# Altium schematic sheet main.SchDoc
size A3
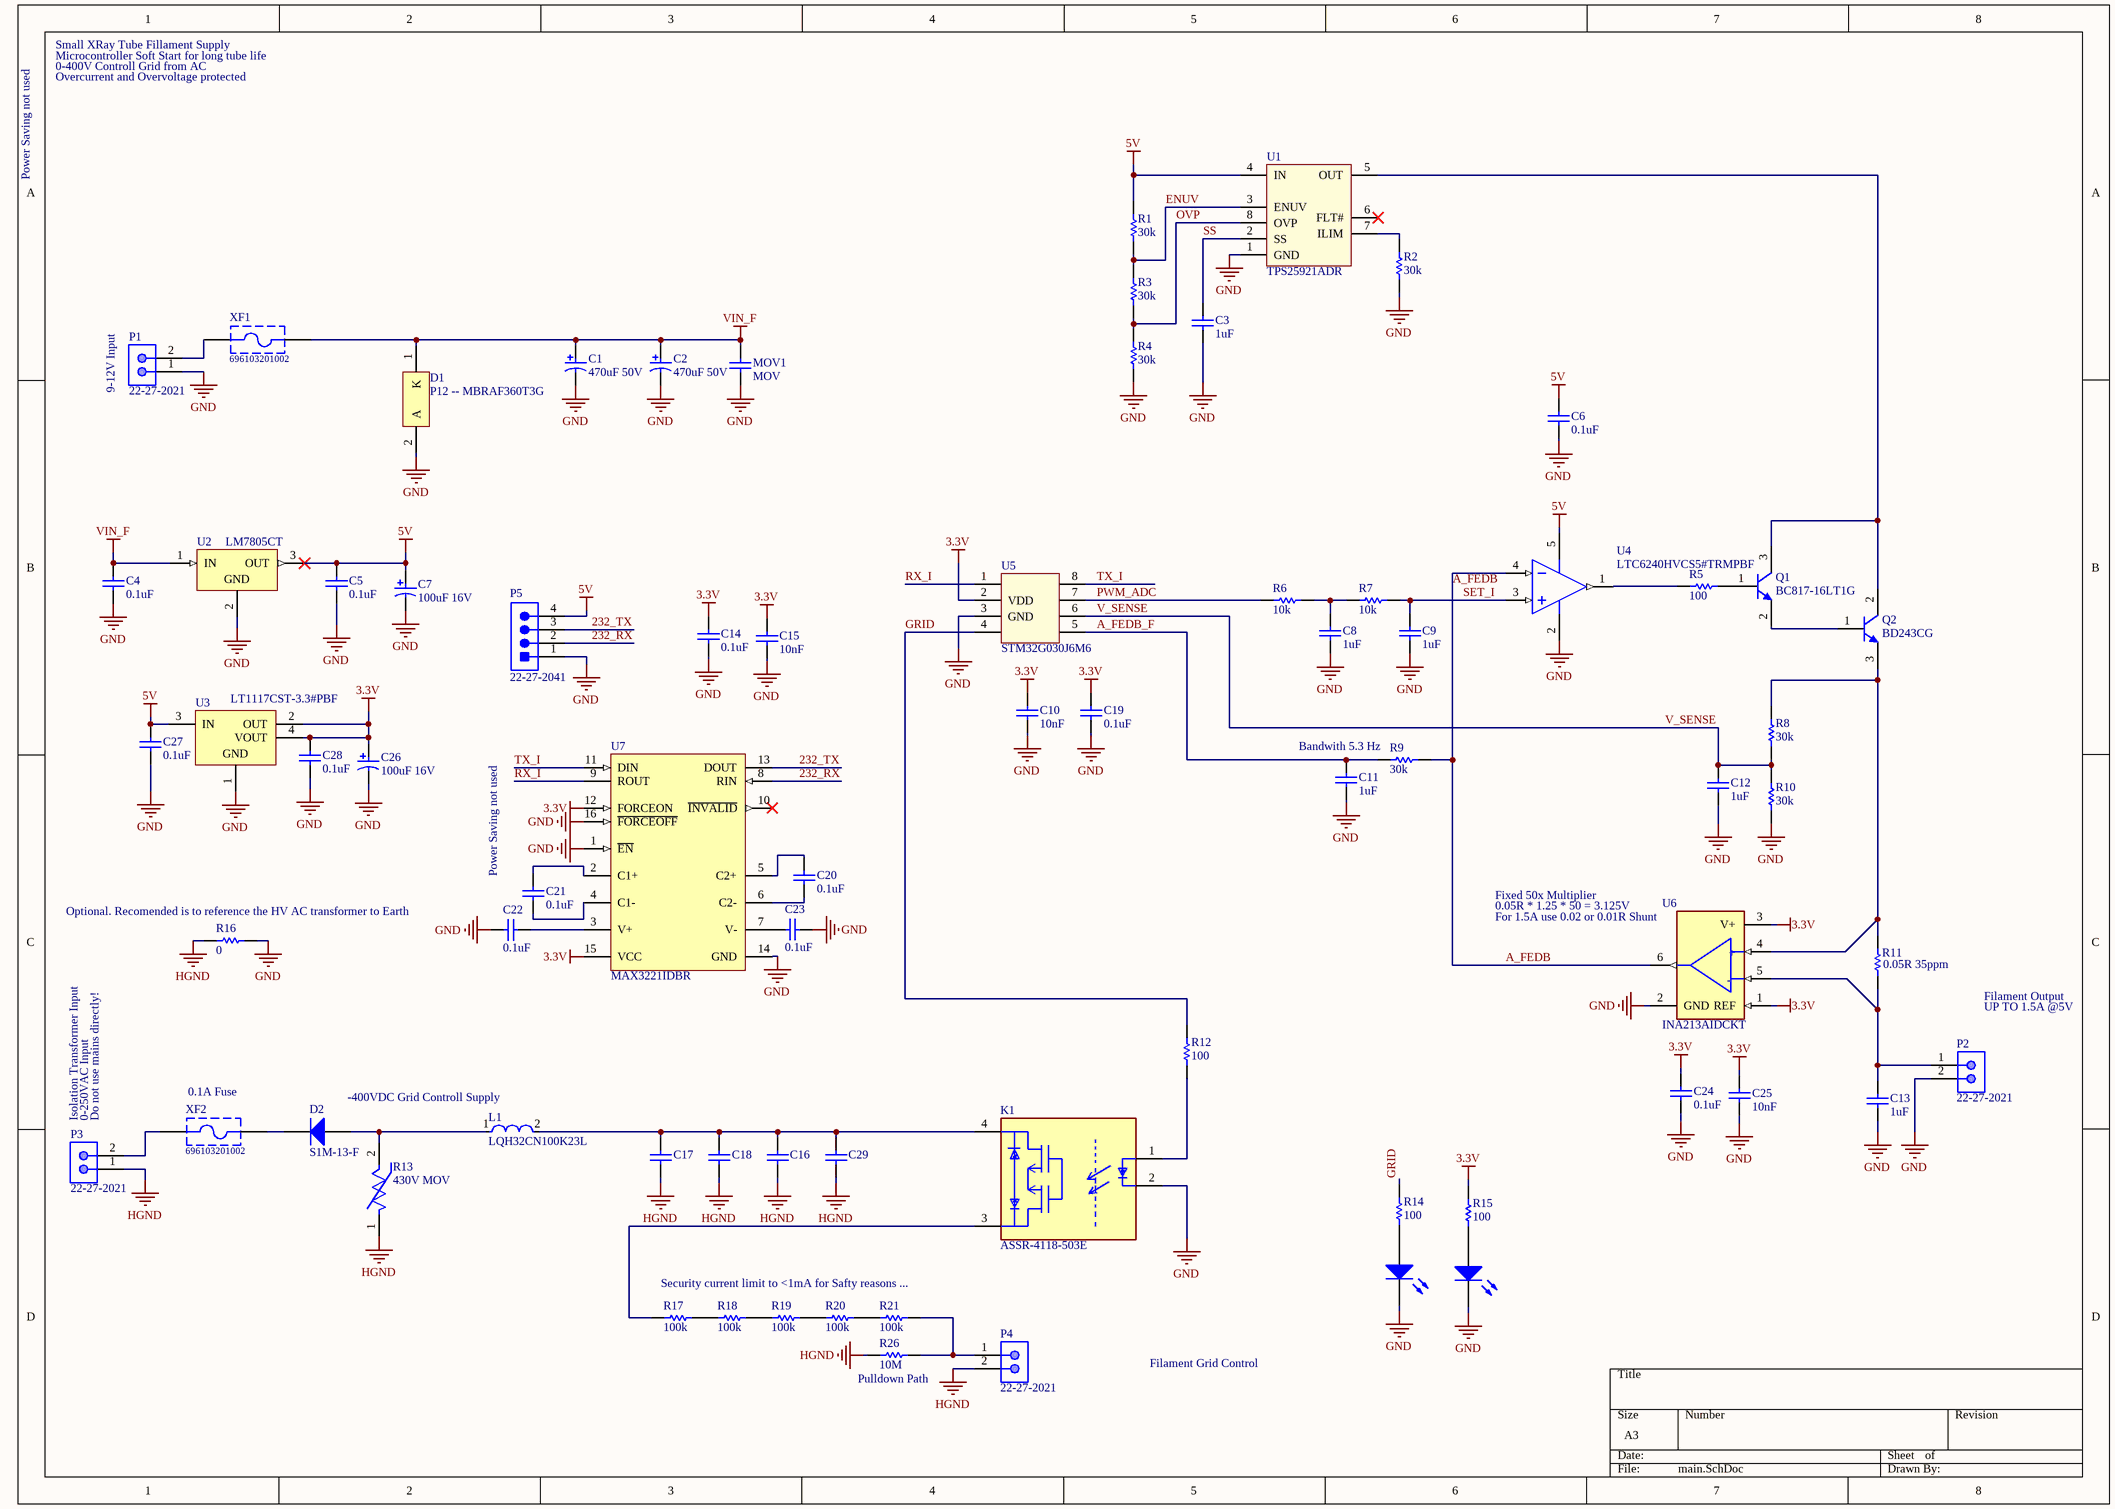
[diagram p0: main.SchDoc]

## Parts
C1  470uF 50V  [PNSC-CAP-10x20-P2]
C2  470uF 50V  [PNSC-CAP-10x20-P2]
C3  1uF  [CAPC2013X145X50LL20T25]
C4  0.1uF  [CAPC2013X145X50LL20T25]
C5  0.1uF  [CAPC2013X145X50LL20T25]
C6  0.1uF  [CAPC2013X145X50LL20T25]
C7  100uF 16V  [CAPPR55-250-1120X630X1220]
C8  1uF  [CAPC2013X145X50LL20T25]
C9  1uF  [CAPC2013X145X50LL20T25]
C10  10nF  [CAPC2013X145X50LL20T25]
C11  1uF  [CAPC2013X145X50LL20T25]
C12  1uF  [CAPC2013X145X50LL20T25]
C13  1uF  [CAPC2013X145X50LL20T25]
C14  0.1uF  [CAPC2013X145X50LL20T25]
C15  10nF  [CAPC2013X145X50LL20T25]
C16  20uF 50V X7R  [CAPC3216X180X50LL20T30]  (value not drawn)
C17  20uF 50V X7R  [CAPC3216X180X50LL20T30]  (value not drawn)
C18  20uF 50V X7R  [CAPC3216X180X50LL20T30]  (value not drawn)
C19  0.1uF  [CAPC2013X145X50LL20T25]
C20  0.1uF  [CAPC2013X145X50LL20T25]
C21  0.1uF  [CAPC2013X145X50LL20T25]
C22  0.1uF  [CAPC2013X145X50LL20T25]
C23  0.1uF  [CAPC2013X145X50LL20T25]
C24  0.1uF  [CAPC2013X145X50LL20T25]
C25  10nF  [CAPC2013X145X50LL20T25]
C26  100uF 16V  [CAPPR55-250-1120X630X1220]
C27  0.1uF  [CAPC2013X145X50LL20T25]
C28  0.1uF  [CAPC2013X145X50LL20T25]
C29  20uF 50V X7R  [CAPC3216X180X50LL20T30]  (value not drawn)
D1  P12 -- MBRAF360T3G  [ONSC-SMA-FL-2-403AA-01_V]
D2  S1M-13-F  [DIOD-S1M-13-F-SMA-2_V]
K1  ASSR-4118-503E  [FP-SO-4-MFG]
L1  LQH32CN100K23L  [FP-LQH32CN100K23L-MFG]
LED1  LED  [0805_A]  (value not drawn)
LED2  LED  [0805_A]  (value not drawn)
MOV1  MOV  [CAPC1206(3216)100_N]
P1  22-27-2021  [MOLX-22-27-2021_V]
P2  22-27-2021  [MOLX-22-27-2021_V]
P3  22-27-2021  [MOLX-22-27-2021_V]
P4  22-27-2021  [MOLX-22-27-2021_V]
P5  22-27-2041  [MOLX-22-27-2041_V]
Q1  BC817-16LT1G  [ONSC-SOT-23-3-318-08_V]
Q2  BD243CG  [ONSC-TO-220-3-221A-09]
R1  30k  [RESC2013X60X40NL20T25]
R2  30k  [RESC2013X60X40NL20T25]
R3  30k  [RESC2013X60X40NL20T25]
R4  30k  [RESC2013X60X40NL20T25]
R5  100  [RESC2013X60X40NL20T25]
R6  10k  [RESC2013X60X40NL20T25]
R7  10k  [RESC2013X60X40NL20T25]
R8  30k  [RESC2013X60X40NL20T25]
R9  30k  [RESC2013X60X40NL20T25]
R10  30k  [RESC2013X60X40NL20T25]
R11  0.05R 35ppm  [RESC3216X60X45ML10T20]
R12  100  [RESC2013X60X40NL20T25]
R13  430V MOV  [FP-B72220S0-MFG]
R14  100  [RESC2013X60X40NL20T25]
R15  100  [RESC2013X60X40NL20T25]
R16  0  [RESC2013X60X40NL20T25]
R17  100k  [RESC2013X50X30NL20T20]
R18  100k  [RESC2013X50X30NL20T20]
R19  100k  [RESC2013X50X30NL20T20]
R20  100k  [RESC2013X50X30NL20T20]
R21  100k  [RESC2013X50X30NL20T20]
R26  10M  [RESC2013X50X30NL20T20]
U1  TPS25921ADR  [SOIC8]
U2  LM7805CT  [FAIR-TO-220-3]
U3  LT1117CST-3.3#PBF  [LT-ST-3-SOT-223_M]
U4  LTC6240HVCS5#TRMPBF  [LT-S5-5-TSOT-23_N]
U5  STM32G030J6M6  [SOIC8]
U6  INA213AIDCKT  [FP-DCK0006A-MFG]
U7  MAX3221IDBR  [DB0016A_L]
XF1  696103201002  [696103201002]
XF2  696103201002  [696103201002]

## Nets
3.3V: C10.2 C14.2 C15.2 C19.2 C24.2 C25.2 C26.1 C28.2 R15.1 U3.2(OUT) U3.4(VOUT) U5.2(VDD) U6.1(REF) U6.3(V+) U7.12(FORCEON) U7.15(VCC)
5V: C5.2 C6.2 C7.1 C27.2 P5.4 R1.1 U1.4(IN) U2.3(OUT) U3.3(IN) U4.5(V+)
GND: C1.2 C2.2 C3.1 C4.1 C5.1 C6.1 C7.2 C8.1 C9.1 C10.1 C11.1 C12.1 C13.1 C14.1 C15.1 C19.1 C22.2 C23.1 C24.1 C25.1 C26.2 C27.1 C28.1 D1.2(A) K1.2(C) LED1.1(K) LED2.1(K) MOV1.1 P1.1 P2.2 P5.1 R2.2 R4.2 R10.1 R16.1 U1.1(GND) U2.2(GND) U3.1(GND) U4.2(V-) U5.3(GND) U6.2(GND) U7.1(~{EN}) U7.14(GND) U7.16(~{FORCEOFF})
HGND: C16.1 C17.1 C18.1 C29.1 P3.1 P4.2 R13.1 R16.2 R26.1
VIN_F: C1.1 C2.1 C4.2 D1.1(K) MOV1.2 U2.1(IN) XF1.2
232_RX: P5.2 U7.8(RIN)
232_TX: P5.3 U7.13(DOUT)
A_FEDB: R9.2 U4.4(-IN) U6.6(OUT)
A_FEDB_F: C11.2 R9.1 U5.5
ENUV: R1.2 R3.1 U1.3(ENUV)
GRID: R12.1 R14.1 U5.4
OVP: R3.2 R4.1 U1.8(OVP)
PWM_ADC: R6.2 U5.7
RX_I: U5.1 U7.9(ROUT)
SET_I: C9.2 R7.1 U4.3(+IN)
SS: C3.2 U1.2(SS)
TX_I: U5.8 U7.11(DIN)
V_SENSE: C12.2 R8.1 R10.2 U5.6
NetC8_2: C8.2 R6.1 R7.2
NetC13_2: C13.2 P2.1 R11.1 U6.5(IN-)
NetC16_2: C16.2 C17.2 C18.2 C29.2 K1.4(2_DRAIN) L1.2
NetC20_1: C20.1 U7.6(C2-)
NetC20_2: C20.2 U7.5(C2+)
NetC21_1: C21.1 U7.4(C1-)
NetC21_2: C21.2 U7.2(C1+)
NetC22_1: C22.1 U7.3(V+)
NetC23_2: C23.2 U7.7(V-)
NetD2_1: D2.1(A) L1.1 R13.2
NetD2_2: D2.2(K) XF2.2
NetK1_1: K1.1(A) R12.2
NetK1_3: K1.3(1_DRAIN) R17.1
NetLED1_2: LED1.2(A) R14.2
NetLED2_2: LED2.2(A) R15.2
NetP1_2: P1.2 XF1.1
NetP3_2: P3.2 XF2.1
NetP4_1: P4.1 R21.2 R26.2
NetQ1_1: Q1.1(B) R5.1
NetQ1_2: Q1.2(E) Q2.1(B)
NetQ1_3: Q1.3(C) Q2.2(C) U1.5(OUT)
NetQ2_3: Q2.3(E) R8.2 R11.2 U6.4(IN+)
NetR2_1: R2.1 U1.7(ILIM)
NetR5_2: R5.2 U4.1(OUT)
NetR17_2: R17.2 R18.1
NetR18_2: R18.2 R19.1
NetR19_2: R19.2 R20.1
NetR20_2: R20.2 R21.1

Not connected (* = marked no-connect by the designer): U1 6(FLT#)*; U7 10(~{INVALID})*

## Notes on the sheet
- Small XRay Tube Fillament Supply
- Microcontroller Soft Start for long tube life
- 0-400V Controll Grid from AC
- Overcurrent and Overvoltage protected
- Power Saving not used
- (near P1) 9-12V Input
- (near R9) Bandwith 5.3 Hz
- Optional. Recomended is to reference the HV AC transformer to Earth
- Fixed 50x Multiplier
- (near U6) 0.05R * 1.25 * 50 = 3.125V
- (near U6) For 1.5A use 0.02 or 0.01R Shunt
- Filament Output
- UP TO 1.5A @5V
- (near P3) Isolation Transformer Input
- (near P3) 0-250VAC Input
- (near P3) Do not use mains directly!
- (near XF2) 0.1A Fuse
- -400VDC Grid Controll Supply
- Security current limit to <1mA for Safty reasons ...
- (near R26) Pulldown Path
- Filament Grid Control
- (in symbol CMP-04895-000035-1) +; -

## Library data of the parts
C1 C2 = CMP-2000-05308-1: Aluminum Electrolytic Capacitor, 470 uF, +/- 20%, 50 V, -55 to 105 degC, 2-Pin THD, RoHS, Bulk; Manufacturer: Panasonic; Package Version: Nov-12; Type: Radial; Lifetime@Temperature: 2000Hrs@105degC; Capacitance: 470µF; Ripple Current: 530mA; Case Size/Dimension: Ø10x20mm; Package Reference: CAP-10x20-P2; Package Description: 2-Pin Through Hole Device, Dia 10 mm, Body Length 20 mm, Pin Spacing 5 mm; Series: NHG; Datasheet Version: Nov-12; Datasheet URL: http://www.alliedelec.com/images/products/datasheets/bm/Panasonic/70067776.pdf; Package URL: http://www.alliedelec.com/images/products/datasheets/bm/Panasonic/70067776.pdf; Operating Temp-Max: 105degC; Operating Temp Range: -55to+105degC; Manufacturer URL: http://www.panasonic.com/; Rated Voltage: 50V
C3-C6 C8-C15 C19-C25 C27 C28 = CMP-2007-01016-1: Manufacturer: Kemet; Part Number: C0805C105K4PACTU
C7 C26 = CMP-1665-00015-4: Aluminum Electrolytic Capacitor (Radial Lead Type), 100 uF, 35 V, -40 to 85 degC, 2-Pin THD, RoHS, Bulk; Manufacturer: Panasonic; Voltage Rating: 35 V; PackageReference: Radial; ComponentLink2URL: http://industrial.panasonic.com/cdbs/www-data/pdf/RDF0000/ABA0000C1047.pdf; DatasheetVersion: 03/2016; REACH SVHC: No SVHC; Mounting Technology: Through Hole; ComponentLink2Description: Datasheet; Packaging: Bulk; Lead Pitch: 2.5 mm; Height: 11.2 mm; Pins: 2; RoHSCompliant: true; Mount: Through Hole; Package Quantity: 200; Min Operating Temperature: -40 degC; Max Operating Temperature: 85 degC; PackageDescription: 2-Pin Through Hole Device, Dia 6.3 mm, Body Length 11.2 mm; ComponentLink1Description: Manufacturer URL; Length: 11.2 mm; ComponentLink1URL: http://www.panasonic.com/
C16-C18 C29 = CMP-2000-07530-1: HighVoltaeCaps; Manufacturer: Samsung Electro-Mechanics; Package Reference: 1206; Package Description: 2-Pin Surface Mount Device, Body 3.2 x 1.6 mm; Datasheet URL: https://media.digikey.com/pdf/Data%20Sheets/Samsung%20PDFs/CL_Series_MLCC_ds.pdf; Manufacturer URL: http://www.samsungsem.com/global/index.jsp; Datasheet Version: 07/2008; Mounting Technology: SurfaceMount
D1 = CMP-1055-00332-1: P12 -- Schottky Power Rectifier, 2-Pin SMA, Pb-Free, Tape and Reel; Manufacturer: On Semiconductor; Configuration: Single; Note1: 0; IFSM Max (A): 125; ComponentLink2Description: Datasheet; ComponentLink3URL: http://www.onsemi.com/pub_link/Collateral/403AA.PDF; ComponentLink1Description: Manufacturer URL; PackageReference: SMA-FL-2-403AA-01; ComponentLink2URL: http://www.onsemi.cn/pub_link/Collateral/MBRAF360-D.PDF; PartNumber: MBRAF360T3G; RoHS: TRUE; DatasheetVersion: Rev. 0; PackageDescription: 2-Pin Small Molded Package, Body 2.6 x 4.3 mm; ComponentLink1URL: http://www.onsemi.com/; Packing: Tape and Reel; ComponentLink3Description: Package Specification; Mounting Technology: Surface Mount; PackageVersion: Rev. O, 03/2011
D2 = CMP-0639-00001-1: Surface Mount Glass Passivated Rectifier, 1000V, 1 A, -65 to 125 degC, 2-Pin SMA Package, RoHS, Tape and Reel; Manufacturer: Diodes Inc; Maximum Reverse Current IR (uA): 5; Maximum Peak Forward Surge Current IFSM (A): 30; Maximum Average Rectified Current IO (A): 1; Peak Repetitive Reverse Voltage VRRM (V): 1000; Total Capacitance CT (pF): 10; Forward Voltage Drop VF (V): 1.1; ComponentLink1URL: http://www.diodes.com/; Operating Temperature Range: -65 to 150 degC; ComponentLink3URL: http://diodes.com/datasheets/ds16003.pdf; ComponentLink3Description: Package Specification; PackageDescription: 2-Pin SMD, Body 4.3 x 2.605 mm, Height 2.3 mm; Mounting Technology: Surface Mount; ComponentLink1Description: Manufacturer URL; PackageReference: S1M-13-F-SMA-2; ComponentLink2URL: http://diodes.com/datasheets/ds16003.pdf; ComponentLink2Description: Datasheet; RoHS: TRUE; DatasheetVersion: Rev. 22 - 2; Packing: Tape and Reel; PackageVersion: Rev. 22 - 2; PartNumber: S1M-13-F
K1 = CMP-18473-000001-1: SSR RELAY SPST-NO 100MA 0-400V; Manufacturer: Broadcom; Manufacturer Part Number: ASSR-1218-503E; Value: 0.4pF; Output Voltage: 60V; Standoff Height: 0mm; Isolation Voltage: 3750Vrms; Output Current: 0.2A; Number Of Contacts: 1; Max Junction Temp: +125°C; Input Current: 25mA; Max Surge Forward Current: 50mA; On State Resistance: 1Ω; Octopart: https://octopart.com/assr-1218-503e-broadcom-71127361; Capacitance: 0.4pF; Temperature: -40°C to +85°C; Height: 2.404mm; Automotive: No; Digikey Description: SSR RELAY SPST-NO 200MA 0-60V; Device Class L1: Electromechanical; Temperature Range High: +85°C; Throw Configuration: SPST-NO; Package: SO-4; RoHS: TRUE; Category: Relay; Device Class L3: Solid State Relays; ComponentLink2Description: Datasheet; Ambient Temperature Range High: +85°C; Ambient Temperature Range Low: -40°C; Device Class L2: Relays; Mouser Description: Solid State Relays - PCB Mount SSR(STD+1A) (60V 0.2A); Lead Free: Yes; Temperature Range Low: -40°C; ComponentLink2URL: https://docs.broadcom.com/docs/AV02-0173EN
L1 = CMP-06042-000010-1: FIXED IND 10UH 300MA 440 MOHM; Manufacturer: Murata; Series Resistance: 0.572Ω; Tolerance: 10%; Self Resonant Frequency: 26MHz; Core Material: Ferrite; Test Frequency: 1MHz; Rms Current: 300mA; ComponentLink2URL: https://psearch.en.murata.com/inductor/product/LQH32CN100K23%23.html; RoHS: TRUE; Digikey Description: FIXED IND 10UH 300MA 440 MOHM; Temperature Range Low: -40°C; Temperature: -40°C to +85°C; Value: 10uH; Octopart: https://octopart.com/lqh32cn100k23l-murata-387507; Category: Ind; Temperature Range High: +85°C; Height: 2.2mm; Automotive: No; Device Class L2: Inductors; ComponentLink2Description: Datasheet; Manufacturer Part Number: LQH32CN100K23L; Inductance: 10uH; Package: LQH32CN100K23L; Device Class L3: Fixed Inductors; Lead Free: Yes; Device Class L1: Passive Components; Footprint Url: https://search.murata.co.jp/Ceramy/image/img/P02/JELF243A-0039.pdf; Composition: Wirewound
LED1 LED2 = CMP-1426-00010-1: SMD mono-color Chip LED, WL-SMCW, Super Red; Manufacturer: Wuerth Elektronik; PartNumber: 150080SS75000; PackageReference: 0805_A; ComponentLink2URL: http://katalog.we-online.com/led/datasheet/150080SS75000.pdf; ComponentLink1URL: http://www.we-online.com; Color: Super Red; ComponentLink2Description: Datasheet; ComponentLink1Description: Manufacturer URL
MOV1 = CMP-1037-01594-1: Case-EIA: 1206; Case-Metric: 3216; Value: 100pF; Tolerance: Â±10%; Rated Voltage: 200 V; Max Thickness: 1 mm; Technology: SMT
P1-P4 = CMP-2000-05537-1: Male Header, Pitch 2.54 mm, 1 x 2 Position, Height 11.7 mm, Tail Length 3.56 mm, 0 to 75 degC, RoHS, Bulk; Manufacturer: Molex; PartNumber: 0022272021; Current rating: 4A; Package Version: Rev. BC, 02/2012; Voltage rating: 250V; No. of Positions: 2; Pitch: 2.54mm; No. of Rows: 1; Orientation: Vertical; Operating temperature: 0°Cto+75°C; Manufacturer URL: http://www.molex.com/; Mounting Technology: ThroughHole; Housing material: Nylon(UL94V-0); Package Description: 2-Leads Header, Body 5.08 x 5.8 mm, Pitch 2.54 mm; Voltage - Max: 250V; Datasheet URL: http://www.molex.com/pdm_docs/sd/022272021_sd.pdf; Package Reference: 22-27-2021; Contact material: Tinplatedbrass; Current - Max: 4A; Datasheet Version: Rev. F, 06/2009
P5 = CMP-2000-05243-1: Male Header, Pitch 2.54 mm, 1 x 4 Position, Height 11.7 mm, Tail Length 3.56 mm, RoHS, Bulk; Manufacturer: Molex; Voltage rating: 250V; Current rating: 4A; Datasheet Version: Rev. F, 06/2009; Operating temperature: 0degCto+75degC; Contact material: Tinplatedbrass; Manufacturer URL: http://www.molex.com/; Housing material: Nylon(UL94V-0); Datasheet URL: http://www.molex.com/pdm_docs/sd/022272041_sd.pdf
Q1 = CMP-1048-00736-1: General Purpose Transistor, NPN Silicon, 3-Pin SOT-23, Pb-Free, Tape and Reel; Manufacturer: On Semiconductor; IC Continuous (A): 0.5; fT Min (MHz): 100; PartNumber: BC817-16LT1G; Mounting Technology: Surface Mount; PackageVersion: Rev. AP, 11/2009; ComponentLink3Description: Package Specification; PackageReference: SOT-23-3-318-08; Packing: Tape and Reel; ComponentLink1URL: http://www.onsemi.com/; Polarity: NPN; RoHS: TRUE; ComponentLink2URL: http://www.onsemi.com/pub_link/Collateral/BC817-16LT1-D.PDF; ComponentLink3URL: http://www.onsemi.cn/pub_link/Collateral/318-08.PDF; ComponentLink2Description: Datasheet; PackageDescription: 3-Pin Small Outline Transistor, Body 2.92 x 1.3 mm, Pitch 0.95 mm; ComponentLink1Description: Manufacturer URL; DatasheetVersion: Rev. 12
Q2 = CMP-1048-01147-1: Complementary Silicon Plastic Power Transistor, 3-Pin TO-220, Pb-Free, Tube; Manufacturer: On Semiconductor; IC Continuous (A): 6; fT Min (MHz): 3; Polarity: NPN; PartNumber: BD243CG; ComponentLink2URL: http://www.onsemi.com/pub_link/Collateral/BD243B-D.PDF; ComponentLink1Description: Manufacturer URL; ComponentLink3Description: Package Specification; Packing: Tube; RoHS: TRUE; PackageReference: TO-220-3-221A-09; PackageDescription: 3-Pin Flange Mount, Vertical Straight Lead, Body 9.97 x 4.445 mm, Pitch 2.54 mm; ComponentLink3URL: http://www.onsemi.com/pub_link/Collateral/221A-09.PDF; ComponentLink1URL: http://www.onsemi.com/; ComponentLink2Description: Datasheet; Mounting Technology: Through Hole; PackageVersion: Rev. AG, 09/2011; DatasheetVersion: Rev. 14
R1-R10 R12 R14-R16 = CMP-2001-00626-1: Manufacturer: Panasonic; Part Number: ERA-6AEB303V
R11 = CMP-2003-02088-1: Part Number: CRCW120630R1FKEA; Manufacturer: Vishay Dale
R13 = CMP-10618-000002-1: 430V MOB; Manufacturer: EPCOS; Manufacturer Part Number: B72220S0300K101; Voltage Rating Dc: 38V; Clamping Voltage: 93V; Clamping Current: 20A; Capacitance: 9350pF; Voltage Rating Ac: 30V; Varistor Voltage: 47V; Value: 9350pF; Voltage Tolerance: 10%; ComponentLink2URL: https://www.tdk-electronics.tdk.com/inf/70/db/var/SIOV_Leaded_StandarD.pdf; Category: Res; Device Class L1: Circuit Protection; ComponentLink2Description: Datasheet; Mouser Description: Epcos Standard Series Metal Oxide Varistor 9.35nF 20A; Clamping 93V; Varistor 47V; Device Class L3: unset; Package: B72220S0; RoHS: TRUE; Octopart: https://octopart.com/b72220s0300k101-epcos-10532994; Height: 25.5mm; Temperature: -40°C to +105°C; Temperature Range High: +105°C; Temperature Range Low: -40°C; Lead Free: Yes; Digikey Description: VARISTOR 47V 2KA DISC 20MM; Device Class L2: Varistors; Automotive: No
R17-R21 R26 = CMP-2001-03930-1: Manufacturer: Vishay Dale; Part Number: CRCW0805470KFKEA
U1 = TPS25921ADR: Electronic Fuse Regulator 1.7A 8-SOIC
U2 = CMP-2000-04938-1: Positive Voltage Regulator, 5 V, 1 A, -40 to 125 degC, 3-Pin TO-220, RoHS, Tube; Manufacturer: FairchildSemiconductor; Maximum Input Voltage: 35V; Maximum Quiescent Current: 8mA; Load Regulation: 100mV; Maximum Output Current: 2.2(Typ)A; Output Type: Fixed; Typical Dropout Voltage @ Current: 2@1AV; Rad Hard: No; Output Voltage: 5V; Accuracy: ±4%; Number of Outputs: 1; Category: LinearRegulator; Package Description: 3-Pin Through Hole Device, Body 10 x 4.5 mm, Pitch 2.54 mm; Packaging: Rail/Tube; Mounting: ThroughHole; Polarity: Positive; Manufacturer URL: https://www.fairchildsemi.com/; Line Regulation: 100mV; Datasheet Version: Aug-12; Datasheet URL: https://datasheet.ciiva.com/26904/lm7805ct-26904988.pdf; Package Reference: TO-220; Package URL: https://www.fairchildsemi.com/package-drawings/TO/TO220B03.pdf; Package: 3TO-220AB; Operating Temperature: -40to125degC; Type: Linear
U3 = CMP-0476-01810-1: 0.8 A Low Dropout Positive Regulator, 2.45 to 15 V Vin, 3.3 V Vout, 3-pin SOT223 (ST-3), 0 to 125 degC, Pb-Free; Manufacturer: Linear Technology; PSRR(dB): 75; Dropout Voltage(V): 1.1; Vin Min(V): 2.45; Vin Max(V): 15; Isupply(mA): 5; Number of Outputs: 1; Discrete Pass Element: no; Output Voltage: 3.3 V; Iout(mA): 800; ComponentLink3URL: http://cds.linear.com/docs/en/packaging/SOT_3_05-08-1630.pdf; PackageVersion: Jun-10; ComponentLink2URL: http://cds.linear.com/docs/en/datasheet/1117fd.pdf; Mounting Technology: Surface Mount; ComponentLink2Description: Datasheet; ComponentLink3Description: Package Specification; PackageReference: ST-3; ComponentLink1Description: Manufacturer URL; PackageDescription: 3-Pin Plastic SOT-223, 3.505 x 6.505 mm Body, Pitch 2.3 mm; RoHS: TRUE; DatasheetVersion: Rev. D; ComponentLink1URL: http://www.linear.com/; PartNumber: LT1117CST-3.3#PBF
U4 = CMP-0359-01964-2: Single Channel, Low Noise, CMOS Operational Amplifier, RRO, 18 MHz Typical GBW, 10 V/us Typical SR, 2.8 to 12 V, 5-Pin SOT23 (S5-5), Commercial, Pb-Free, Mini Reel; Manufacturer: Linear Technology; Is (mA) Typical: 2; GBW (MHz) Typical: 18; SR (V/us) Typical: 10; Vs Max (V): 12; Vs Min (V): 2.8; Vos (mV) Typical: 0.04; Channels (#): 1; ComponentLink1URL: http://www.linear.com/; Code_JEDEC: MO-193; ComponentLink2Description: Datasheet; Type: VFB; ComponentLink3Description: Package Specification; RoHS: Pb-Free; RevisionNote: URLs updated; PackageDescription: 5-Lead Plastic TSOT-23, Body 1.63 x 2.90 mm, Pitch 0.95 mm; PartNumber: LTC6240HVCS5#TRMPBF; ComponentLink2URL: http://cds.linear.com/docs/en/datasheet/624012fe.pdf; PackageReference: LT-S5-5-TSOT-23; ComponentLink3URL: http://cds.linear.com/docs/en/packaging/SOT_5_05-08-1635.pdf; DatasheetVersion: Rev. E; ComponentLink1Description: Manufacturer URL; Linear Technology Part Number: LTC6240HV; Packing: Mini Reel; Mounting Technology: Surface Mount
U6 = CMP-04895-000035-1: IC CURR SENSE 1 CIRCUIT SC70-6; Manufacturer: Texas Instruments; Standoff Height: 0mm; Input Bias Current: 35uA; Max Junction Temp: +150°C; Number Of Channels: 1; Max Supply Voltage: 26V; Min Supply Voltage: 2.7V; Nominal Supply Current: 100uA; Gain Bandwidth: 80kHz; Height: 0.8mm; Device Class L3: Amplifiers - Op Amps; Category: IC; Device Class L1: Integrated Circuits (ICs); Digikey Description: IC CURR SENSE 1 CIRCUIT SC70-6; Temperature Range High: +125°C; Device Class L2: Linear ICs; Package: DCK0006A; Mouser Description: SP Amp Current Shunt Monitor Single 26V 6-Pin SC-70 T/R; RoHS: TRUE; Automotive: No; Octopart: https://octopart.com/ina213aidckt-texas+instruments-7767892; Lead Free: Yes; Manufacturer Part Number: INA213AIDCKT; Temperature Range Low: -40°C; Ambient Temperature Range High: +125°C; ComponentLink2URL: http://www.ti.com/lit/ds/symlink/ina211.pdf; Ambient Temperature Range Low: -40°C; Temperature: -40°C to +125°C; ComponentLink2Description: Datasheet
U7 = CMP-0299-01333-2: 3-V to 5.5-V Single-Channel RS-232 Line Driver / Receiver with ±15-kV ESD Protection, -40 to 85 degC, 16-Pin SSOP (DB), Green (RoHS & no Sb/Br); RS-232: TRUE; Supply Voltage(s)(V): 3.3 or 5.0; ESD HBM(kV): +/-15; Drivers Per Package: 1; ComponentLink2Description: Datasheet; PackageDescription: 16-Pin Plastic Small Outline Package, 6.2 x 5.3 mm Body, 0.65 mm Pitch; PackageVersion: revE, Dec-2001; ComponentLink1Description: Manufacturer URL; DatasheetVersion: SLLS348M; PackageReference: DB0016A; ComponentLink3URL: http://www.ti.com/litv/pdf/msso002e; ICC(Max)(mA): 1; SubFamily: RS-232; ComponentLink1URL: www.ti.com; ComponentLink3Description: Package Specification; Single Supply: TRUE; Receivers Per Package: 1; ComponentLink2URL: http://www.ti.com/general/docs/lit/getliterature.tsp?genericPartNumber=MAX3221&fileType=pdf
XF1 XF2 = CMP-1502-00239-1: WR-FSH Fuse Holder Blocks Fuse Holder Blocks Clip Cover for PCB - THR Version; Manufacturer: Wurth Elektronik; Fuse Size: 5x20mm; Package Reference: 696103201002; Operating Temperature: -30to120degC; Part Number: 696103201002; Packaging: Box; Datasheet URL: https://katalog.we-online.de/em/datasheet/696103201002.pdf; Publisher: WurthElektronik; Mounting Technology: THR; Manufacturer URL: http://www.we-online.de